# EAGLE design oshi-fuse-board-mk-1.1-mini-ato (EAGLE 6.5.0)
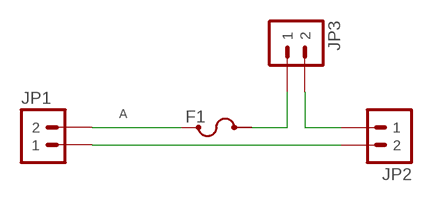
[diagram p0: schematic, sheet 1]

## Parts
F1  FUSEMINI-AUTO  [KEYSTONE-MINI-AUTO-FUSE-HOLDER]
JP1  M025MM  [SCREWTERMINAL-5MM-2]
JP2  M025MM  [SCREWTERMINAL-5MM-2]
JP3  M025MM  [SCREWTERMINAL-5MM-2]

## Nets
A: F1.P1@1 F1.P1@2 JP1.2
N$1: JP1.1 JP2.2
N$2: F1.P2@1 F1.P2@2 JP3.1
N$3: JP2.1 JP3.2

## Library data of the parts
F1 = A_butts:FUSE
JP1-JP3 = A_butts:M02: Standard 2-pin 0.1" header. Use with - straight break away headers ( PRT-00116) - right angle break away headers (PRT-00553) - swiss pins (PRT-00743) - machine pins (PRT-00117) - female headers (PRT-00115) Molex polarized connector foot print use with: PRT-08233 with associated crimp pins and housings. 2.54_SCREWTERM for use with PRT-10571. 3.5mm Screw Terminal footprints for PRT-08084 5mm Screw Terminal footprints for use with PRT-08433

## Board
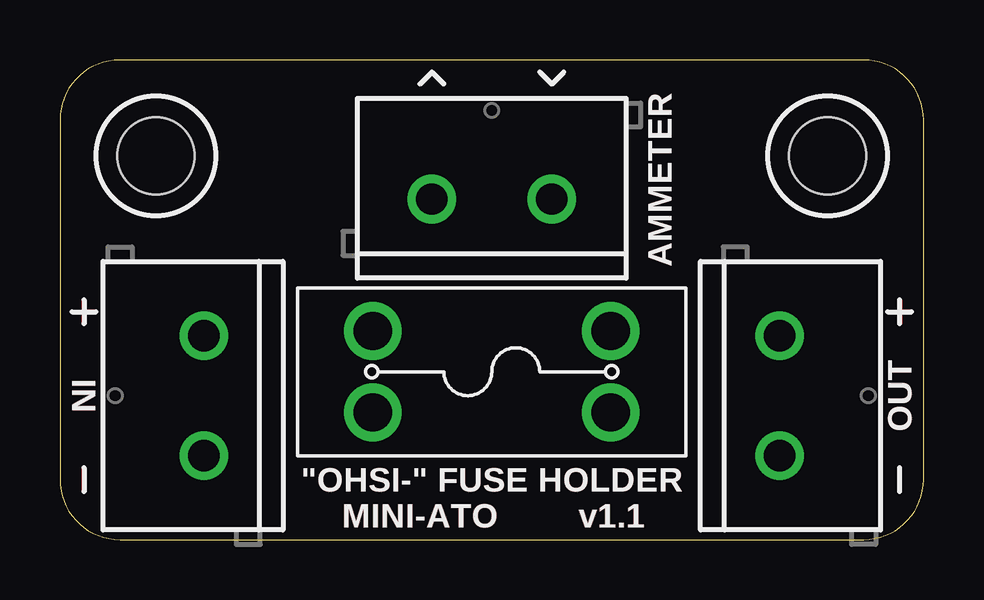
[diagram p1: board, top side]
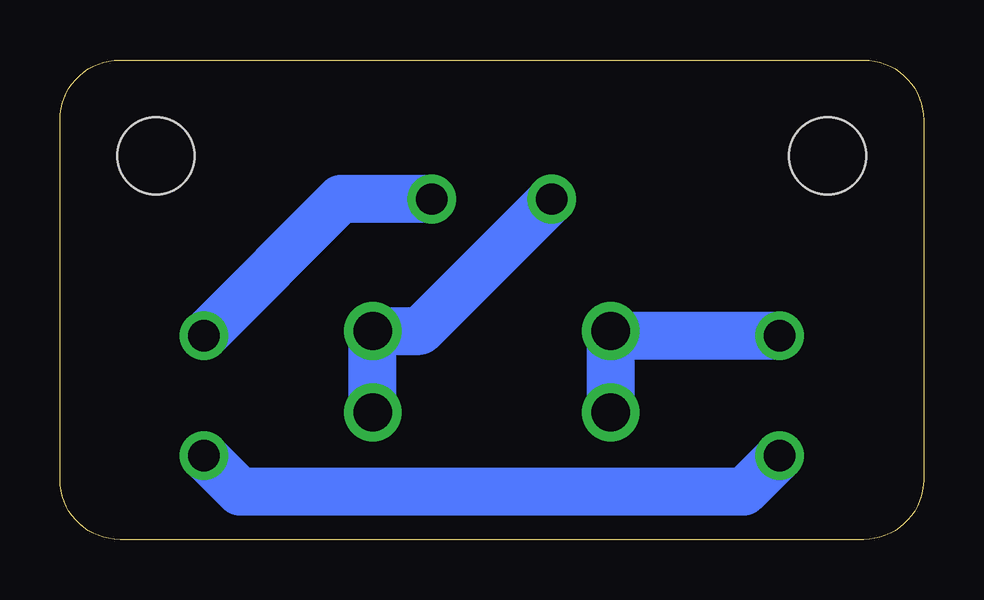
[diagram p2: board, bottom side, seen from below]

Size 36 x 20 mm. Coordinates in mm from the lower left corner, seen from the top.
Outline: 2.5,0 33.5,0 arc90 36,2.5 36,17.5 arc90 33.5,20 2.5,20 arc90 0,17.5 0,2.5 arc90 2.5,0
Copper layers (1*16): Top 0.0356mm / dielectric 1.5011mm / Bottom 0.0356mm
Design rules "LaenPCBOrder_2": minimum track width 6mil, minimum drill 13mil, track to track 6mil, track to pad 6mil, pad to pad 6mil, via to via 6mil, smd to smd 6mil, copper to edge 15mil, drill to drill 6mil, minimum pad ring 7mil, minimum via ring 7mil, stop-mask expansion 3mil, vias tented up to drill 20mil, thermal gap 10mil
Holes 3.2 mm at 4,16 32,16

### Footprints (pad centres in the part's own frame; a part is rotated, then mirrored left to right if it is on the bottom)
KEYSTONE-MINI-AUTO-FUSE-HOLDER = drill 1.6: P1@1 -4.96,1.7; P1@2 -4.96,-1.7; P2@1 4.96,1.7; P2@2 4.96,-1.7
SCREWTERMINAL-5MM-2 = drill 1.3 pad 2.032: 1 -2.5,0; 2 2.5,0

### Placement (x,y rotation side)
F1  18,7 0 top
JP1  6,6 90 top
JP2  30,6 270 top
JP3  18,14.2 0 top

### Tracks (layer width: path | path; a pad name or v marks a point on that pad's centre or on a via)
A
  Bottom 2: JP1.2 12.84,8.5 F1.P1@1 F1.P1@2
N$1
  Bottom 2: JP1.1 7.5,2 28.5,2 JP2.2
N$2
  Bottom 2: F1.P2@2 F1.P2@1 21,8.7 JP3.1
N$3
  Bottom 2: JP3.2 24.3,14.2 JP2.1
N$4
  Top 0.2: 0.5,9.5 1,9.5 | 1,9 1,9.5 | 1.5,9.5 1,9.5 | 1,9.5 1,10
N$5
  Top 0.2: 34.5,9.5 35,9.5 | 35,10 35,9.5 | 35.5,9.5 35,9.5 | 35,9.5 35,9
N$6
  Top 0.2: 1,2 1,3
N$7
  Top 0.2: 35,2 35,3
N$8
  Top 0.2: 20,19.5 20.5,19 21,19.5
N$9
  Top 0.2: 15,19 15.5,19.5 16,19

### Text on the board
Top: AMMETER | IN | OUT | "OHSI-" FUSE HOLDER | MINI-ATO
tPlace: AMMETER | IN | OUT | "OHSI-" FUSE HOLDER | MINI-ATO